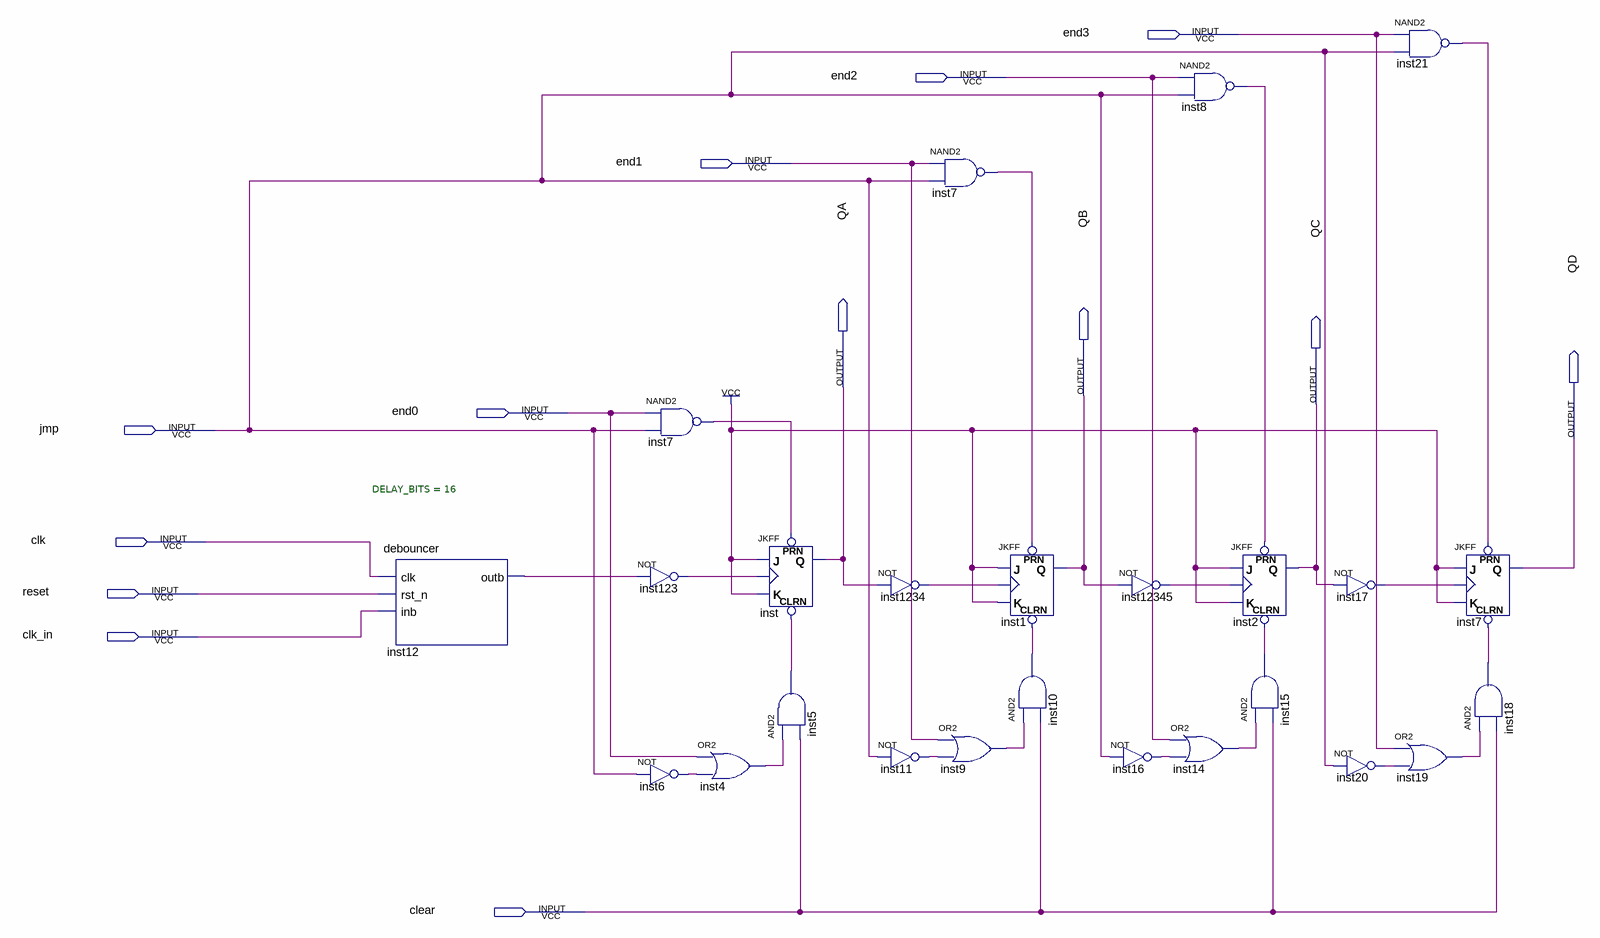
[diagram p0: schematic sheet]
// Quartus schematic jmp_block.bdf as structural Verilog: 25 symbols, 13 pins
module jmp_block (
  input  end3,
  input  end2,
  input  end1,
  input  end0,
  input  jmp,
  input  clk,
  input  reset,
  input  clk_in,
  input  clear,
  output QA,
  output QB,
  output QC,
  output QD
);

  wire inst4_out, inst5_out, inst6_out, inst7_out, inst7_out_2, inst8_out, inst9_out, inst10_out, inst11_out,
       inst12_outb, inst14_out, inst15_out, inst16_out, inst17_out, inst18_out, inst19_out, inst20_out,
       inst21_out, inst123_out, inst1234_out, inst12345_out;

  debouncer #(.DELAY_BITS(16)) inst12 (.clk(clk), .rst_n(reset), .inb(clk_in), .outb(inst12_outb));
  nand inst7 (inst7_out, end0, jmp);
  not inst123 (inst123_out, inst12_outb);
  not inst6 (inst6_out, jmp);
  or inst4 (inst4_out, end0, inst6_out);
  JKFF inst (.PRN(inst7_out), .CLRN(inst5_out), .K(1'b1), .J(1'b1), .CLK(inst123_out), .Q(QA));
  and inst5 (inst5_out, inst4_out, clear);
  nand inst7_dup2 (inst7_out_2, end1, jmp);
  not inst1234 (inst1234_out, QA);
  or inst9 (inst9_out, end1, inst11_out);
  not inst11 (inst11_out, jmp);
  JKFF inst1 (.PRN(inst7_out_2), .CLRN(inst10_out), .K(1'b1), .J(1'b1), .CLK(inst1234_out), .Q(QB));
  and inst10 (inst10_out, inst9_out, clear);
  not inst12345 (inst12345_out, QB);
  not inst16 (inst16_out, jmp);
  nand inst8 (inst8_out, end2, jmp);
  or inst14 (inst14_out, end2, inst16_out);
  JKFF inst2 (.PRN(inst8_out), .CLRN(inst15_out), .K(1'b1), .J(1'b1), .CLK(inst12345_out), .Q(QC));
  and inst15 (inst15_out, inst14_out, clear);
  not inst17 (inst17_out, QC);
  not inst20 (inst20_out, jmp);
  nand inst21 (inst21_out, end3, jmp);
  or inst19 (inst19_out, end3, inst20_out);
  JKFF inst7_dup3 (.PRN(inst21_out), .CLRN(inst18_out), .K(1'b1), .J(1'b1), .CLK(inst17_out), .Q(QD));
  and inst18 (inst18_out, inst19_out, clear);
endmodule
